# Altium schematic sheet AddressingMuxes_2.SchDoc
size A4
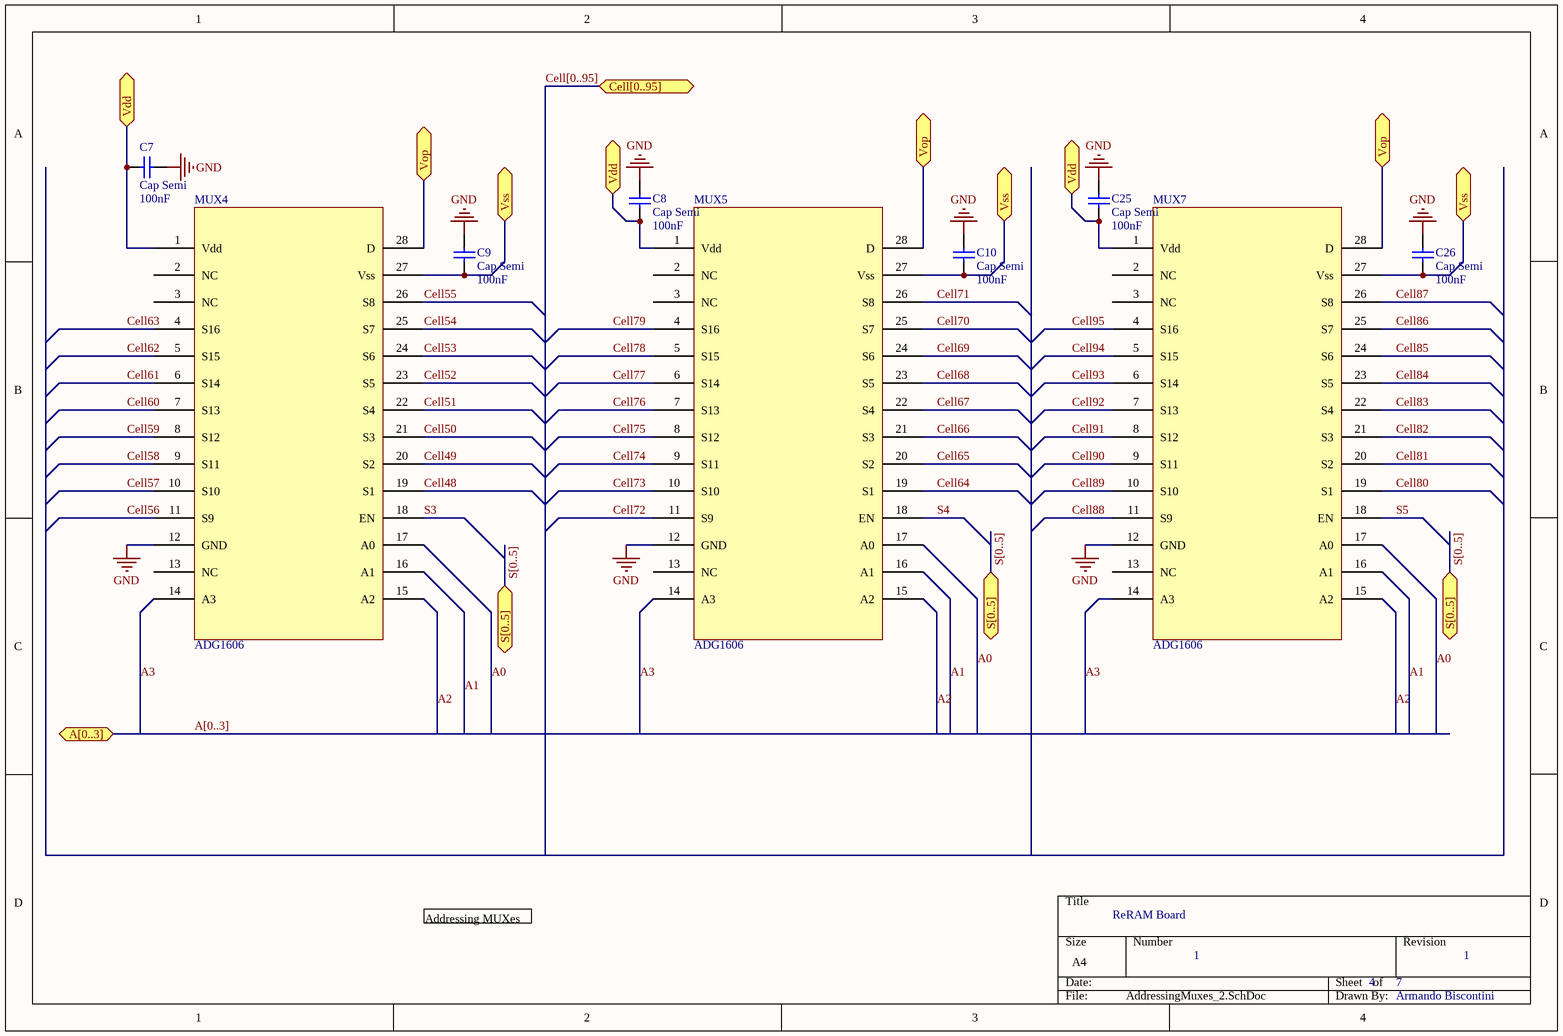
[diagram p0: AddressingMuxes_2.SchDoc]

## Parts
C7  Cap Semi  value 100nF  [C1206]
C8  Cap Semi  value 100nF  [C1206]
C9  Cap Semi  value 100nF  [C1206]
C10  Cap Semi  value 100nF  [C1206]
C25  Cap Semi  value 100nF  [C1206]
C26  Cap Semi  value 100nF  [C1206]
MUX4  ADG1606  [TSOP65P640X120-28N]
MUX5  ADG1606  [TSOP65P640X120-28N]
MUX7  ADG1606  [TSOP65P640X120-28N]

## Ports
A[0..3], Cell[0..95], S[0..5], Vdd, Vop, Vss

## Nets
GND: C7.2 C8.1 C9.1 C10.1 C25.1 C26.1 MUX4.12(GND) MUX5.12(GND) MUX7.12(GND)
A0: MUX4.17(A0) MUX5.17(A0) MUX7.17(A0)
A1: MUX4.16(A1) MUX5.16(A1) MUX7.16(A1)
A2: MUX4.15(A2) MUX5.15(A2) MUX7.15(A2)
A3: MUX4.14(A3) MUX5.14(A3) MUX7.14(A3)
Cell48: MUX4.19(S1)
Cell49: MUX4.20(S2)
Cell50: MUX4.21(S3)
Cell51: MUX4.22(S4)
Cell52: MUX4.23(S5)
Cell53: MUX4.24(S6)
Cell54: MUX4.25(S7)
Cell55: MUX4.26(S8)
Cell56: MUX4.11(S9)
Cell57: MUX4.10(S10)
Cell58: MUX4.9(S11)
Cell59: MUX4.8(S12)
Cell60: MUX4.7(S13)
Cell61: MUX4.6(S14)
Cell62: MUX4.5(S15)
Cell63: MUX4.4(S16)
Cell64: MUX5.19(S1)
Cell65: MUX5.20(S2)
Cell66: MUX5.21(S3)
Cell67: MUX5.22(S4)
Cell68: MUX5.23(S5)
Cell69: MUX5.24(S6)
Cell70: MUX5.25(S7)
Cell71: MUX5.26(S8)
Cell72: MUX5.11(S9)
Cell73: MUX5.10(S10)
Cell74: MUX5.9(S11)
Cell75: MUX5.8(S12)
Cell76: MUX5.7(S13)
Cell77: MUX5.6(S14)
Cell78: MUX5.5(S15)
Cell79: MUX5.4(S16)
Cell80: MUX7.19(S1)
Cell81: MUX7.20(S2)
Cell82: MUX7.21(S3)
Cell83: MUX7.22(S4)
Cell84: MUX7.23(S5)
Cell85: MUX7.24(S6)
Cell86: MUX7.25(S7)
Cell87: MUX7.26(S8)
Cell88: MUX7.11(S9)
Cell89: MUX7.10(S10)
Cell90: MUX7.9(S11)
Cell91: MUX7.8(S12)
Cell92: MUX7.7(S13)
Cell93: MUX7.6(S14)
Cell94: MUX7.5(S15)
Cell95: MUX7.4(S16)
S3: MUX4.18(EN)
S4: MUX5.18(EN)
S5: MUX7.18(EN)
Vdd: C7.1 C8.2 C25.2 MUX4.1(Vdd) MUX5.1(Vdd) MUX7.1(Vdd) ; port Vdd
Vop: MUX4.28(D) MUX5.28(D) MUX7.28(D) ; port Vop
Vss: C9.2 C10.2 C26.2 MUX4.27(Vss) MUX5.27(Vss) MUX7.27(Vss) ; port Vss

Not connected (* = marked no-connect by the designer): MUX4 2(NC) 3(NC) 13(NC); MUX5 2(NC) 3(NC) 13(NC); MUX7 2(NC) 3(NC) 13(NC)

## Buses and harness runs
bus A[0..3] = port A[0..3]
bus Cell[0..95] = port Cell[0..95]
bus S[0..5] = port S[0..5]

## Notes on the sheet
- Addressing MUXes
- ReRAM Board
- 1
- 4
- 7
- Armando Biscontini

## Library data of the parts
C7-C10 C25 C26 = Cap Semi: Capacitor (Semiconductor SIM Model); Published: 8-Jun-2000; LatestRevisionDate: 29-May-2009; LatestRevisionNote: IPC-7351 Footprint Added.; PackageReference: C1206; Publisher: Altium Limited; PackageDescription: Chip Capacitor
MUX4 MUX5 MUX7 = ADG1606: Analog Devices ADG1606